# Altium schematic sheet USB_UART.SchDoc: USB UART
size Letter; Engineer: Nathan Petersen; DocumentNumber: 23; Revision: v1.2; SheetNumber: 23; SheetTotal: 25
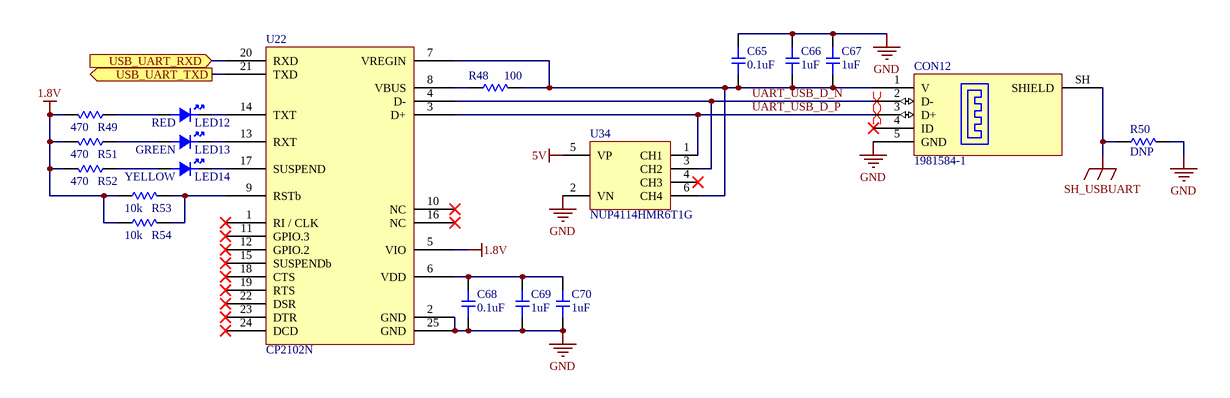
[diagram p0: USB_UART.SchDoc]

## Parts
C65  value 0.1uF  [0603-CAP]  (hidden comment: Capacitor)
C66  value 1uF  [0603-CAP]  (hidden comment: Capacitor)
C67  value 1uF  [0603-CAP]  (hidden comment: Capacitor)
C68  value 0.1uF  [0603-CAP]  (hidden comment: Capacitor)
C69  value 1uF  [0603-CAP]  (hidden comment: Capacitor)
C70  value 1uF  [0603-CAP]  (hidden comment: Capacitor)
CON12  1981584-1  [1981584-1]
LED12  value RED  [0603-LED]  (hidden comment: LED)
LED13  value GREEN  [0603-LED]  (hidden comment: LED)
LED14  value YELLOW  [0603-LED]  (hidden comment: LED)
R48  value 100  [0603-RES]  (hidden comment: Resistor)
R49  value 470  [0603-RES]  (hidden comment: Resistor)
R50  value DNP  [0603-RES]  (hidden comment: Resistor)
R51  value 470  [0603-RES]  (hidden comment: Resistor)
R52  value 470  [0603-RES]  (hidden comment: Resistor)
R53  value 10k  [0603-RES]  (hidden comment: Resistor)
R54  value 10k  [0603-RES]  (hidden comment: Resistor)
U22  CP2102N  [QFN50P400X400X80_HS-25N]
U34  NUP4114HMR6T1G  [TSOP95P280X110-6N]

## Ports
USB_UART_RXD (in), USB_UART_TXD (out)

## Nets
1.8V: R49.2 R51.2 R52.2 R53.1 R54.1 U22.5(VIO)
5V: U34.5(VP)
GND: C65.2 C66.2 C67.2 C68.1 C69.1 C70.1 CON12.5(GND) R50.2 U22.2(GND) U22.25(GND) U34.2(VN)
SH_USBUART: CON12.SH(SHIELD) R50.1
UART_USB_D_N: CON12.2(D-) U22.4(D-) U34.3(CH2)
UART_USB_D_P: CON12.3(D+) U22.3(D+) U34.1(CH1)
USB_UART_RXD: U22.20(RXD) ; port USB_UART_RXD
USB_UART_TXD: U22.21(TXD) ; port USB_UART_TXD
NetC65_1: C65.1 C66.1 C67.1 CON12.1(V) R48.2 U22.7(VREGIN) U34.6(CH4)
NetC68_2: C68.2 C69.2 C70.2 U22.6(VDD)
NetLED12_A: LED12.A R49.1
NetLED12_C: LED12.C U22.14(TXT)
NetLED13_A: LED13.A R51.1
NetLED13_C: LED13.C U22.13(RXT)
NetLED14_A: LED14.A R52.1
NetLED14_C: LED14.C U22.17(SUSPEND)
NetR48_1: R48.1 U22.8(VBUS)
NetR53_2: R53.2 R54.2 U22.9(RSTb)

Not connected (* = marked no-connect by the designer): CON12 4(ID)*; U22 1(RI_/_CLK)* 10(NC)* 11(GPIO.3)* 12(GPIO.2)* 15(SUSPENDb)* 16(NC)* 18(CTS)* 19(RTS)* 22(DSR)* 23(DTR)* 24(DCD)*; U34 4(CH3)*

## Layout directives
differential pair: UART_USB_D_N, UART_USB_D_P

## Notes on the sheet
- Title:
- File:
- Sheet:
- of
- Revision:
- Time:
- Date:
- Engineer:

## Library data of the parts
CON12 = 1981584-1: CONN RCPT MICRO USB TYPE AB; Supplier 1: Digi-Key; Supplier Part Number 1: A97799TR-ND
U22 = CP2102N: IC USB TO UART BRIDGE QFN24; Supplier 1: Digi-Key; Supplier Part Number 1: 336-5888-1-ND
U34 = NUP4114HMR6T1G: TVS DIODE 5.5V 10V 6TSOP; Supplier 1: Digi-Key; Supplier Part Number 1: NUP4114HMR6T1GOSCT-ND
C65-C70 = Capacitor: Supplier 1: Digi-Key
  C65 C68: Supplier Part Number 1: 1276-1012-6-ND
  C66 C67 C69 C70: Supplier Part Number 1: 1276-6524-6-ND
LED12-LED14 = LED: Supplier 1: Digi-Key
  LED12: Supplier Part Number 1: 160-1447-6-ND
  LED13: Supplier Part Number 1: 160-1446-6-ND
  LED14: Supplier Part Number 1: 160-1448-6-ND
R48-R54 = Resistor: Supplier 1: Digi-Key
  R48: Supplier Part Number 1: YAG3561DKR-ND
  R49 R51 R52: Supplier Part Number 1: 311-470LDCT-ND
  R50: Supplier Part Number 1: P0.0GDKR-ND
  R53 R54: Supplier Part Number 1: P10.0KHCT-ND